# EAGLE schematic EngineeringModelBoard(6-2015) (Lee Jenny의 충돌된 사본 2015-08-19) (EAGLE 7.3.0)

## Sheet 1 of 7: µC and Programming
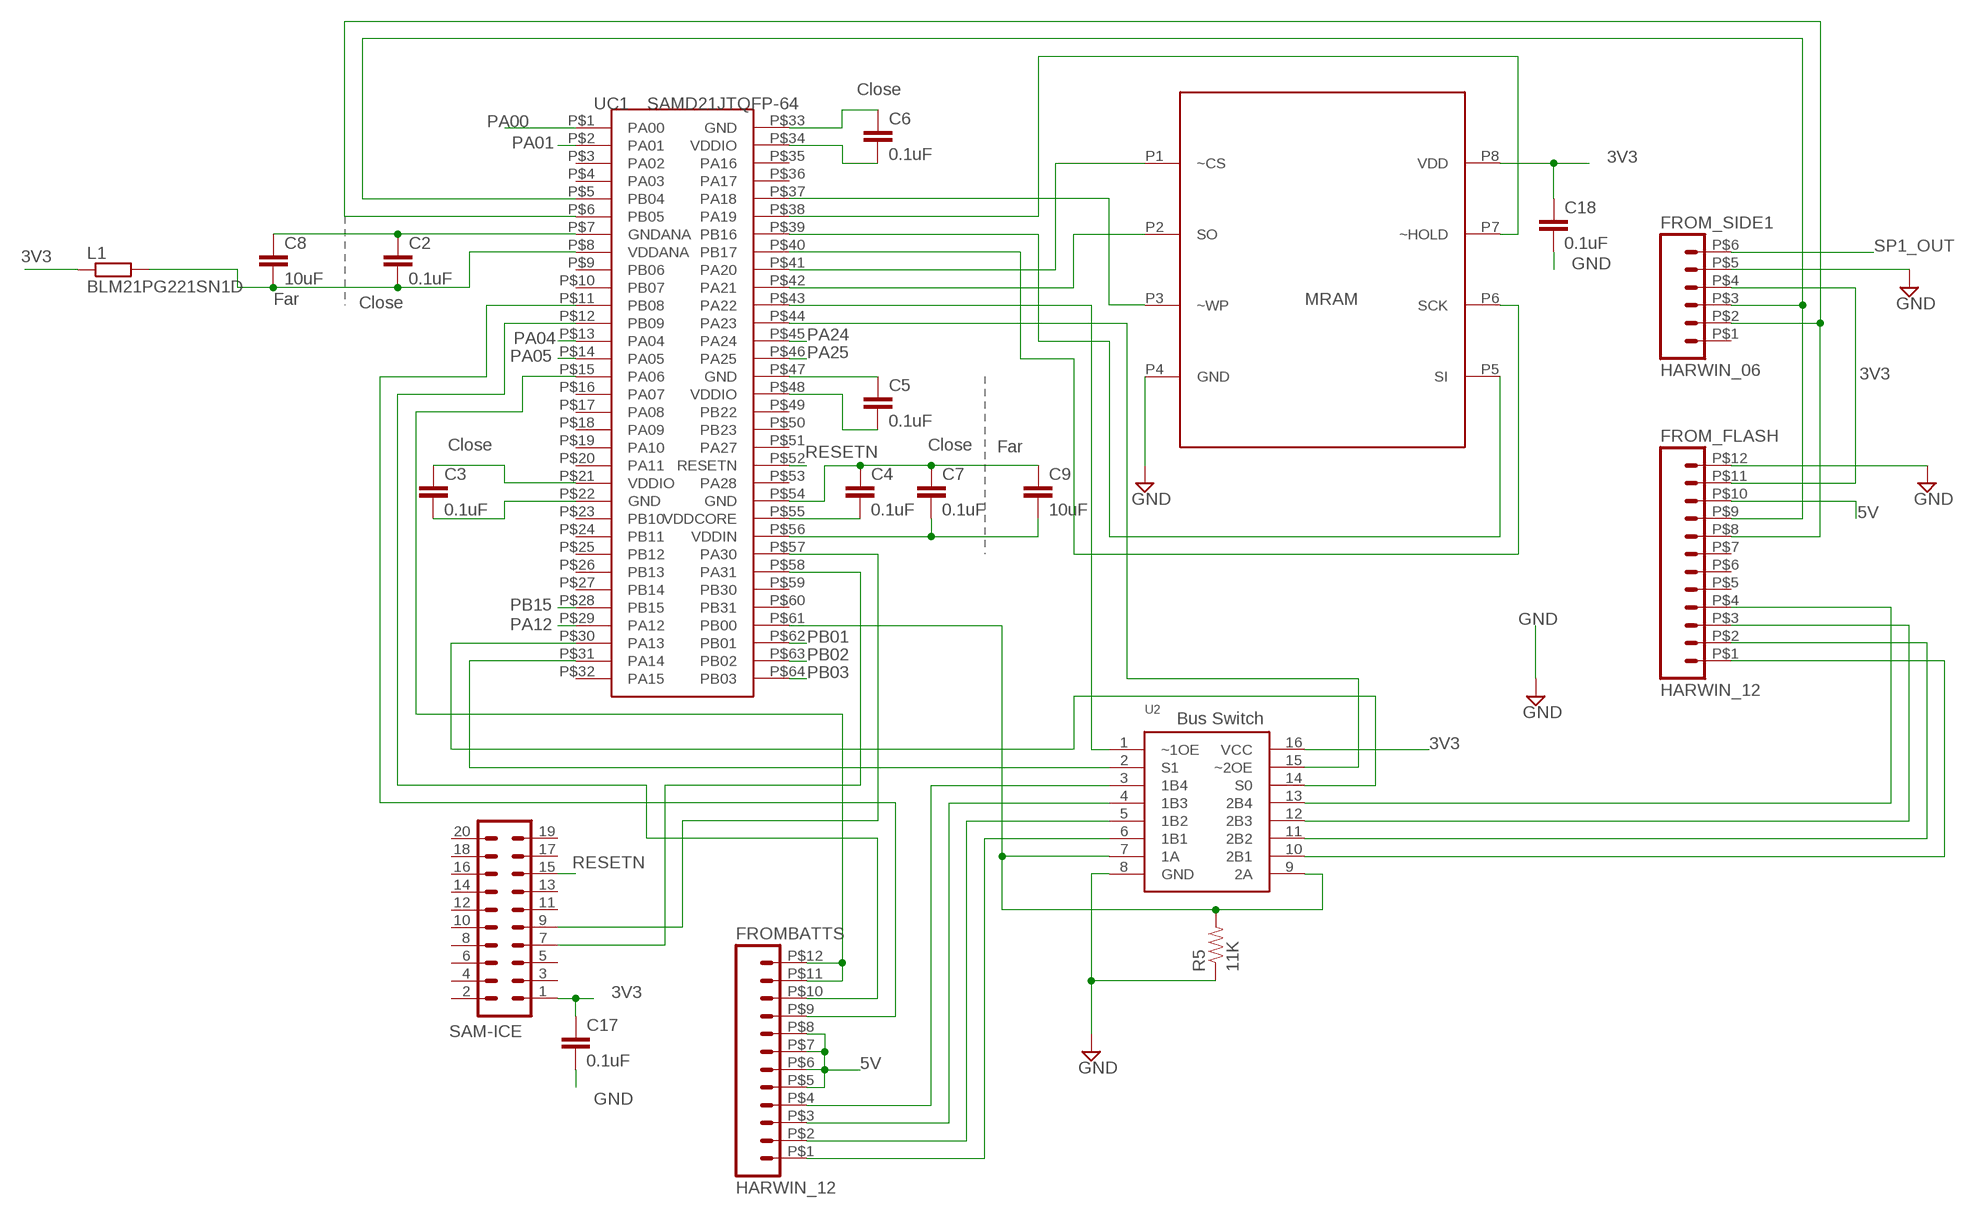
[diagram p0: schematic, sheet 1]

### Parts
C2  0.1uF  CAP0805  [0805]
C3  0.1uF  CAP0805  [0805]
C4  0.1uF  CAP0805  [0805]
C5  0.1uF  CAP0805  [0805]
C6  0.1uF  CAP0805  [0805]
C7  0.1uF  CAP0805  [0805]
C8  10uF  CAP0805  [0805]
C9  10uF  CAP0805  [0805]
C17  0.1uF  CAP0805  [0805]
C18  0.1uF  CAP0805  [0805]
FROM_FLASH  HARWIN_12  [HARWIN_DATAMATE_12]
FROM_SIDE1  HARWIN_06  [HARWIN_DATAMATE_6]
FROMBATTS  HARWIN_12  [HARWIN_DATAMATE_12]
L1  BLM21PG221SN1D  R-EU_R0805  [R0805]
R5  11K  RESISTOR  [0805]
SAM-ICE  IDC_JTAG_CONNECTOR  [2X10]
U2  SN74CBTLV3253  [SOIC16R]
U$3  MRAM  MR25H10CDC  [8PXMO-229]
UC1  SAMD21JTQFP-64  [TQFP-64]

### Nets
3V3: C17.1 C18.1 FROM_FLASH.P$11 FROM_SIDE1.P$4 L1.1 SAM-ICE.1 U2.16(VCC) U$3.P8(VDD) ; also sheet 4,5
5V: FROM_FLASH.P$10 FROMBATTS.P$5 FROMBATTS.P$6 FROMBATTS.P$7 FROMBATTS.P$8 ; also sheet 4
GND: C2.1 C4.1 C5.1 C6.1 C7.1 C8.1 C9.1 C17.2 C18.2 FROM_FLASH.P$12 FROM_SIDE1.P$5 R5.1 U2.8(GND) U$3.P4(GND) UC1.P$7(GNDANA) UC1.P$33(GND) UC1.P$47(GND) UC1.P$54(GND) ; also sheet 4,5,6
H1.2: FROM_FLASH.P$8 FROM_SIDE1.P$2 UC1.P$6(PB05)
H1.3: FROM_FLASH.P$9 FROM_SIDE1.P$3 UC1.P$5(PB04)
N$15: C3.1 UC1.P$21(VDDIO)
N$16: U$3.P1(~CS) UC1.P$41(PA20)
N$17: R5.2 U2.7(1A) U2.9(2A) UC1.P$61(PB00)
N$18: U$3.P2(SO) UC1.P$42(PA21)
N$19: U$3.P3(~WP) UC1.P$37(PA18)
N$20: FROM_FLASH.P$1 U2.10(2B1)
N$21: FROM_FLASH.P$2 U2.11(2B2)
N$22: FROM_FLASH.P$3 U2.12(2B3)
N$23: FROM_FLASH.P$4 U2.13(2B4)
N$24: FROMBATTS.P$1 U2.6(1B1)
N$25: FROMBATTS.P$2 U2.5(1B2)
N$26: FROMBATTS.P$3 U2.4(1B3)
N$27: FROMBATTS.P$4 U2.3(1B4)
N$28: U2.14(S0) UC1.P$30(PA13)
N$29: U2.2(S1) UC1.P$31(PA14)
N$30: U2.1(~1OE) UC1.P$43(PA22)
N$31: U2.15(~2OE) UC1.P$44(PA23)
N$32: C5.2 UC1.P$48(VDDIO)
N$34: U$3.P7(~HOLD) UC1.P$38(PA19)
N$35: U$3.P6(SCK) UC1.P$40(PB17)
N$37: C7.2 C9.2 UC1.P$56(VDDIN)
N$38: SAM-ICE.7 UC1.P$58(PA31)
N$39: SAM-ICE.9 UC1.P$57(PA30)
N$41: C3.2 UC1.P$22(GND)
N$42: U$3.P5(SI) UC1.P$39(PB16)
N$43: C2.2 C8.2 L1.2 UC1.P$8(VDDANA)
N$44: FROMBATTS.P$9 UC1.P$11(PB08)
N$47: C4.2 UC1.P$55(VDDCORE)
N$49: C6.2 UC1.P$34(VDDIO)
N$51: FROMBATTS.P$10 UC1.P$12(PB09)
N$52: FROMBATTS.P$11 FROMBATTS.P$12 UC1.P$15(PA06)
PA00: UC1.P$1(PA00) ; also sheet 5
PA01: UC1.P$2(PA01) ; also sheet 5
PA04: UC1.P$13(PA04) ; also sheet 5
PA05: UC1.P$14(PA05) ; also sheet 5
PA12: UC1.P$29(PA12) ; also sheet 5
PA24: UC1.P$45(PA24) ; also sheet 6
PA25: UC1.P$46(PA25) ; also sheet 6
PB01: UC1.P$62(PB01) ; also sheet 6
PB02: UC1.P$63(PB02) ; also sheet 6
PB03: UC1.P$64(PB03) ; also sheet 6
PB15: UC1.P$28(PB15) ; also sheet 5
RESETN: SAM-ICE.15 UC1.P$52(RESETN)
SP1_OUT: FROM_SIDE1.P$6
Unconnected: FROM_FLASH.P$5 FROM_FLASH.P$6 FROM_FLASH.P$7 FROM_SIDE1.P$1 SAM-ICE.2 SAM-ICE.3 SAM-ICE.4 SAM-ICE.5 SAM-ICE.6 SAM-ICE.8 SAM-ICE.10 SAM-ICE.11 SAM-ICE.12 SAM-ICE.13 SAM-ICE.14 SAM-ICE.16 SAM-ICE.17 SAM-ICE.18 SAM-ICE.19 SAM-ICE.20 UC1.P$3(PA02) UC1.P$4(PA03) UC1.P$9(PB06) UC1.P$10(PB07) UC1.P$16(PA07) UC1.P$17(PA08) UC1.P$18(PA09) UC1.P$19(PA10) UC1.P$20(PA11) UC1.P$23(PB10) UC1.P$24(PB11) UC1.P$25(PB12) UC1.P$26(PB13) UC1.P$27(PB14) UC1.P$32(PA15) UC1.P$35(PA16) UC1.P$36(PA17) UC1.P$49(PB22) UC1.P$50(PB23) UC1.P$51(PA27) UC1.P$53(PA28) UC1.P$59(PB30) UC1.P$60(PB31)

### Notes on the sheet
- Close
- Far | Close | MRAM
- Close | Close | Far
- Bus Switch

## Sheet 2 of 7: Flash Panel
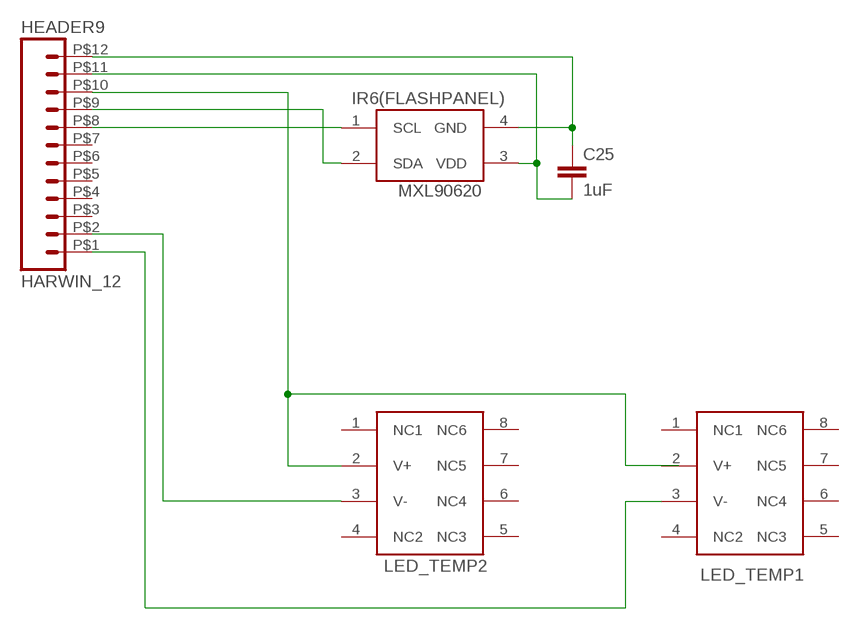
[diagram p1: schematic, sheet 2]

### Parts
C25  1uF  CAP0805  [0805]
HEADER9  HARWIN_12  [HARWIN_DATAMATE_12]
IR6(FLASHPANEL)  MXL90620  [MXL90620]
LED_TEMP_1  AD590  [SO8]
LED_TEMP_2  AD590  [SO8]

### Nets
N$8: HEADER9.P$8 IR6(FLASHPANEL).1(SCL)
N$10: HEADER9.P$9 IR6(FLASHPANEL).2(SDA)
N$11: C25.1 HEADER9.P$12 IR6(FLASHPANEL).4(GND)
N$12: C25.2 HEADER9.P$11 IR6(FLASHPANEL).3(VDD)
N$13: HEADER9.P$2 LED_TEMP_2.3(V-)
N$14: HEADER9.P$10 LED_TEMP_2.2(V+)
N$33: HEADER9.P$1 LED_TEMP_1.3(V-)
Unconnected: HEADER9.P$3 HEADER9.P$4 HEADER9.P$5 HEADER9.P$6 HEADER9.P$7 LED_TEMP_1.1(NC1) LED_TEMP_1.2(V+) LED_TEMP_1.4(NC2) LED_TEMP_1.5(NC3) LED_TEMP_1.6(NC4) LED_TEMP_1.7(NC5) LED_TEMP_1.8(NC6) LED_TEMP_2.1(NC1) LED_TEMP_2.4(NC2) LED_TEMP_2.5(NC3) LED_TEMP_2.6(NC4) LED_TEMP_2.7(NC5) LED_TEMP_2.8(NC6)

### Notes on the sheet
- LED_TEMP2
- LED_TEMP1

## Sheet 3 of 7: Side 1
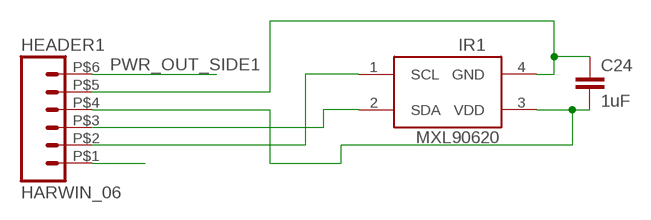
[diagram p2: schematic, sheet 3]

### Parts
C24  1uF  CAP0805  [0805]
HEADER1  HARWIN_06  [HARWIN_DATAMATE_6]
IR1  MXL90620  [MXL90620]

### Nets
H1.1: HEADER1.P$1
N$2: HEADER1.P$2 IR1.1(SCL)
N$6: HEADER1.P$3 IR1.2(SDA)
N$7: C24.2 HEADER1.P$4 IR1.3(VDD)
N$9: C24.1 HEADER1.P$5 IR1.4(GND)
PWR_OUT_SIDE1: HEADER1.P$6

## Sheet 4 of 7: Power Regulation
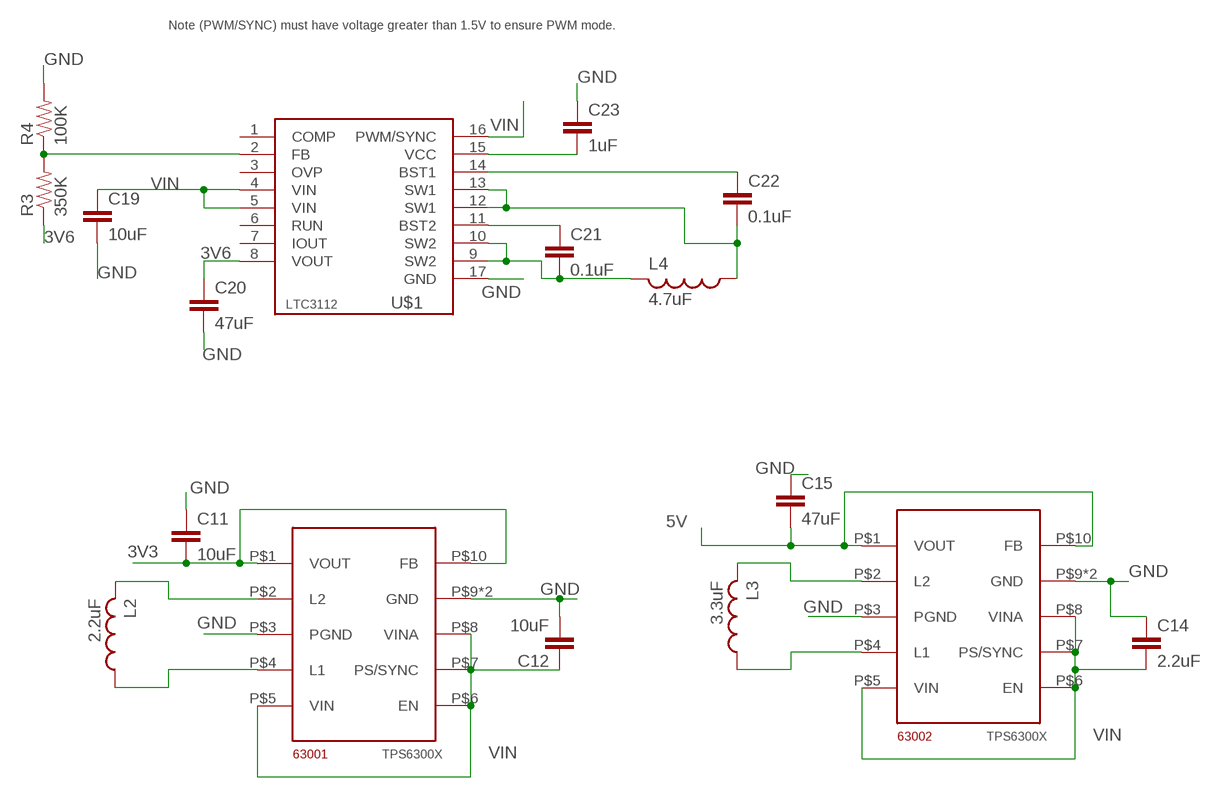
[diagram p3: schematic, sheet 4]

### Parts
63001  TPS6300X  [QFN10_POWERPAD]
63002  TPS6300X  [QFN10_POWERPAD]
C11  10uF  CAP0603-CAP  [0603-CAP]
C12  10uF  CAP0603-CAP  [0603-CAP]
C14  2.2uF  CAP0603-CAP  [0603-CAP]
C15  47uF  CAP0603-CAP  [0603-CAP]
C19  10uF  CAP0603-CAP  [0603-CAP]
C20  47uF  CAP0603-CAP  [0603-CAP]
C21  0.1uF  CAP0603-CAP  [0603-CAP]
C22  0.1uF  CAP0603-CAP  [0603-CAP]
C23  1uF  CAP0603-CAP  [0603-CAP]
L2  2.2uF  L-USL3225M  [L3225M]
L3  3.3uF  L-USL3225M  [L3225M]
L4  4.7uF  L-USL3225M  [L3225M]
R3  350K  RESISTOR  [0805]
R4  100K  RESISTOR  [0805]
U$1  LTC3112  [DHD16]

### Nets
3V3: 63001.P$1(VOUT) 63001.P$10(FB) C11.2 ; also sheet 1,5
3V6: C20.1 R3.1 U$1.8(VOUT) ; also sheet 6
5V: 63002.P$1(VOUT) 63002.P$10(FB) C15.2 ; also sheet 1
GND: 63001.P$3(PGND) 63001.P$9(GND) 63001.PAD(GND) 63002.P$3(PGND) 63002.P$9(GND) 63002.PAD(GND) C11.1 C12.2 C14.1 C15.1 C19.2 C20.2 C23.1 R4.2 U$1.17(GND) ; also sheet 1,5,6
N$3: C21.1 U$1.11(BST2)
N$4: C22.1 U$1.14(BST1)
N$5: C23.2 U$1.15(VCC)
N$40: C22.2 L4.1 U$1.12(SW1) U$1.13(SW1)
N$45: 63002.P$2(L2) L3.2
N$46: 63002.P$4(L1) L3.1
N$48: 63001.P$2(L2) L2.2
N$50: 63001.P$4(L1) L2.1
N$53: C21.2 L4.2 U$1.9(SW2) U$1.10(SW2)
N$54: R3.2 R4.1 U$1.2(FB)
VIN: 63001.P$5(VIN) 63001.P$6(EN) 63001.P$7(PS/SYNC) 63001.P$8(VINA) 63002.P$5(VIN) 63002.P$6(EN) 63002.P$7(PS/SYNC) 63002.P$8(VINA) C12.1 C14.2 C19.1 U$1.4(VIN) U$1.5(VIN) U$1.16(PWM/SYNC)
Unconnected: U$1.1(COMP) U$1.3(OVP) U$1.6(RUN) U$1.7(IOUT)

### Notes on the sheet
- Note (PWM/SYNC) must have voltage greater than 1.5V to ensure PWM mode.

## Sheet 5 of 7: Sensors
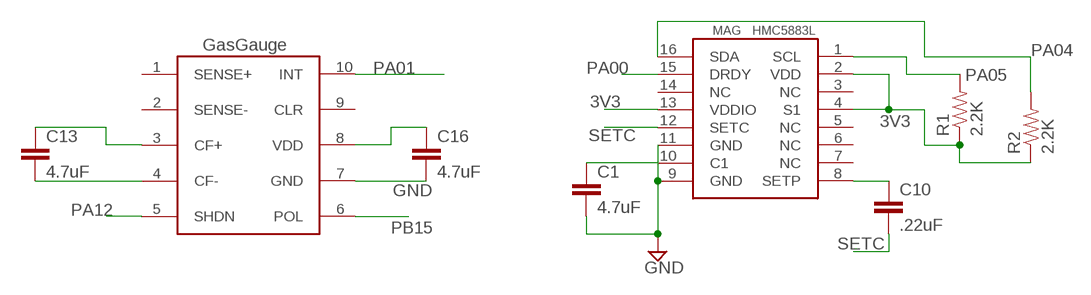
[diagram p4: schematic, sheet 5]

### Parts
C1  4.7uF  CAP0805  [0805]
C10  .22uF  CAP0805  [0805]
C13  4.7uF  CAP0805  [0805]
C16  4.7uF  CAP0805  [0805]
MAG  HMC5883L  [HMC5883L]
R1  2.2K  RESISTOR  [0805]
R2  2.2K  RESISTOR  [0805]
U$2  LTC4150  [MSOP10]

### Nets
3V3: MAG.2(VDD) MAG.4(S1) MAG.13(VDDIO) R1.1 R2.1 ; also sheet 1,4
GND: C1.2 C16.2 MAG.9(GND) MAG.11(GND) U$2.7(GND) ; also sheet 1,4,6
N$1: C1.1 MAG.10(C1)
N$36: C10.1 MAG.8(SETP)
N$57: C13.1 U$2.3(CF+)
N$58: C13.2 U$2.4(CF-)
N$59: C16.1 U$2.8(VDD)
PA00: MAG.15(DRDY) ; also sheet 1
PA01: U$2.10(INT) ; also sheet 1
PA04: MAG.16(SDA) R2.2 ; also sheet 1
PA05: MAG.1(SCL) R1.2 ; also sheet 1
PA12: U$2.5(SHDN) ; also sheet 1
PB15: U$2.6(POL) ; also sheet 1
SETC: C10.2 MAG.12(SETC)
Unconnected: MAG.3(NC) MAG.5(NC) MAG.6(NC) MAG.7(NC) MAG.14(NC) U$2.1(SENSE+) U$2.2(SENSE-) U$2.9(CLR)

### Notes on the sheet
- GasGauge

## Sheet 6 of 7: Radio
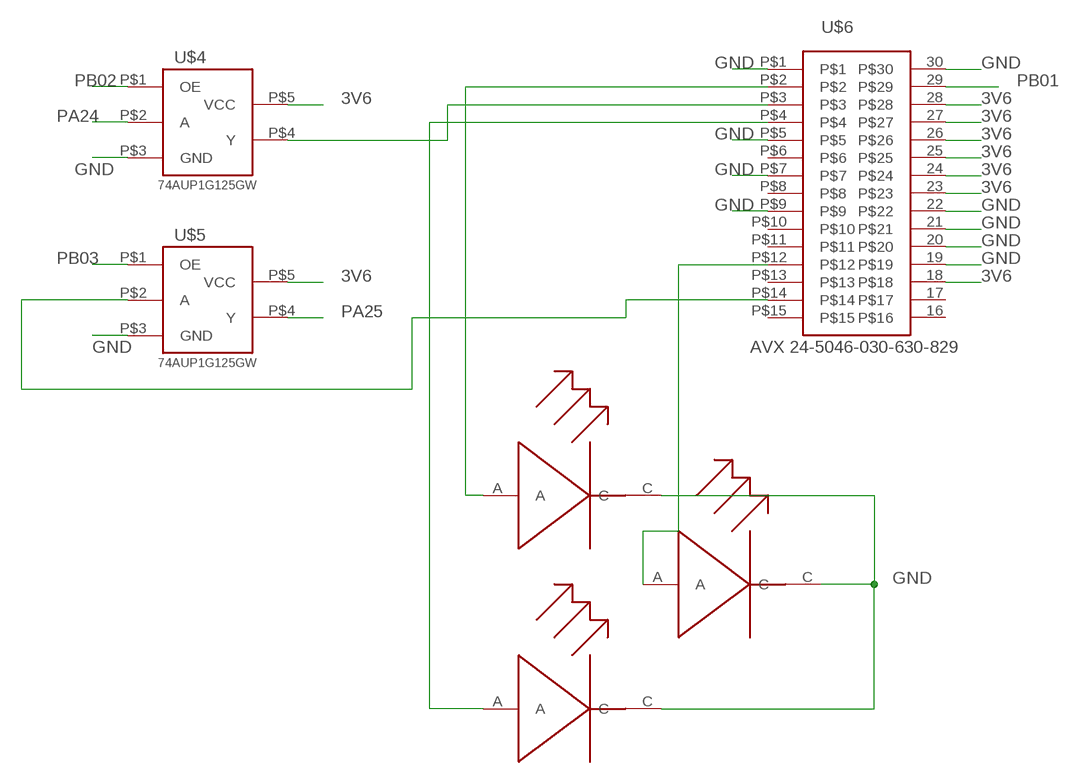
[diagram p5: schematic, sheet 6]

### Parts
U$4  74AUP1G125GW  [TSSOP-5]
U$5  74AUP1G125GW  [TSSOP-5]
U$6  AVX-24-5046-030-630-829  [AVX-24-5046-630-829]
U$11  LT-T673-Q1R2-25-Z  [PLCC-2]
U$12  LT-T673-Q1R2-25-Z  [PLCC-2]
U$13  LT-T673-Q1R2-25-Z  [PLCC-2]

### Nets
3V6: U$4.P$5(VCC) U$5.P$5(VCC) U$6.18 U$6.23 U$6.24 U$6.25 U$6.26 U$6.27 U$6.28 ; also sheet 4
AVXCON3: U$4.P$4(Y) U$6.P$3
AVXCON14: U$5.P$2(A) U$6.P$14
GND: U$4.P$3(GND) U$5.P$3(GND) U$6.19 U$6.20 U$6.21 U$6.22 U$6.30 U$6.P$1 U$6.P$5 U$6.P$7 U$6.P$9 U$11.C U$12.C U$13.C ; also sheet 1,4,5
N$66: U$6.P$2 U$13.A
N$67: U$6.P$4 U$12.A
N$68: U$6.P$12 U$11.A
PA24: U$4.P$2(A) ; also sheet 1
PA25: U$5.P$4(Y) ; also sheet 1
PB01: U$6.29 ; also sheet 1
PB02: U$4.P$1(OE) ; also sheet 1
PB03: U$5.P$1(OE) ; also sheet 1
Unconnected: U$6.16 U$6.17 U$6.P$6 U$6.P$8 U$6.P$10 U$6.P$11 U$6.P$13 U$6.P$15

## Sheet 7 of 7: Batteries
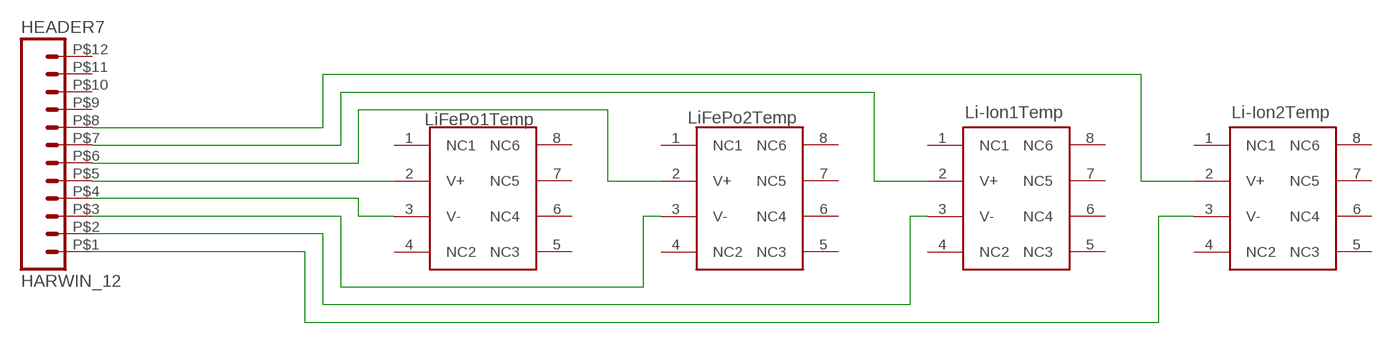
[diagram p6: schematic, sheet 7]

### Parts
HEADER7  HARWIN_12  [HARWIN_DATAMATE_12]
U$7  AD590  [SO8]
U$8  AD590  [SO8]
U$9  AD590  [SO8]
U$10  AD590  [SO8]

### Nets
N$55: HEADER7.P$4 U$7.3(V-)
N$56: HEADER7.P$3 U$8.3(V-)
N$60: HEADER7.P$2 U$9.3(V-)
N$61: HEADER7.P$1 U$10.3(V-)
N$62: HEADER7.P$5 U$7.2(V+)
N$63: HEADER7.P$6 U$8.2(V+)
N$64: HEADER7.P$7 U$9.2(V+)
N$65: HEADER7.P$8 U$10.2(V+)
Unconnected: HEADER7.P$9 HEADER7.P$10 HEADER7.P$11 HEADER7.P$12 U$7.1(NC1) U$7.4(NC2) U$7.5(NC3) U$7.6(NC4) U$7.7(NC5) U$7.8(NC6) U$8.1(NC1) U$8.4(NC2) U$8.5(NC3) U$8.6(NC4) U$8.7(NC5) U$8.8(NC6) U$9.1(NC1) U$9.4(NC2) U$9.5(NC3) U$9.6(NC4) U$9.7(NC5) U$9.8(NC6) U$10.1(NC1) U$10.4(NC2) U$10.5(NC3) U$10.6(NC4) U$10.7(NC5) U$10.8(NC6)

### Notes on the sheet
- Li-Ion1Temp | Li-Ion2Temp
- LiFePo1Temp | LiFePo2Temp

## Library data of the parts
63001 63002 = CNTRL_BOARD:TPS6300X
C1-C25 = CNTRL_BOARD:CAP: Capacitor Standard 0603 ceramic capacitor, and 0.1" leaded capacitor.
FROM_FLASH FROMBATTS HEADER7 HEADER9 = CNTRL_BOARD:HARWIN_12
FROM_SIDE1 HEADER1 = CNTRL_BOARD:HARWIN_06
IR1 IR6(FLASHPANEL) = CNTRL_BOARD:MXL90620
L1 = rcl:R-EU_: RESISTOR, European symbol
L2-L4 = resistor:L-US: INDUCTOR, American symbol
LED_TEMP_1 LED_TEMP_2 U$7-U$10 = analog-devices:AD590
MAG = CNTRL_BOARD:HMC5883L
R1-R5 = CNTRL_BOARD:RESISTOR
SAM-ICE = CNTRL_BOARD:IDC_JTAG_CONNECTOR
U2 = CNTRL_BOARD:SN74CBTLV3253
U$1 = CNTRL_BOARD:LTC3112
U$2 = linear-technology:LTC4150
U$3 = mram:MR25H10CDC
U$4 U$5 = CNTRL_BOARD:74AUP1G125GW
U$6 = CNTRL_BOARD:AVX-24-5046-030-630-829
U$11-U$13 = CNTRL_BOARD:LT-T673-Q1R2-25-Z
UC1 = SAMD21J:SAMD21J